# EAGLE design Sensor Short Link (EAGLE 9.6.1)
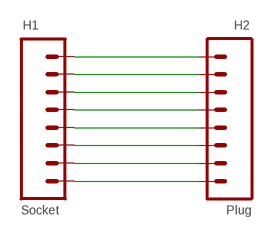
[diagram p0: schematic, sheet 1]

## Parts
H1  Socket  HEADER-1X8-GENERIC  [CONN_08-GENERIC]
H2  Plug  HEADER-1X8-GENERIC  [CONN_08-GENERIC]

## Nets
N$1: H1.8 H2.8
N$2: H1.7 H2.7
N$3: H1.6 H2.6
N$4: H1.5 H2.5
N$5: H1.4 H2.4
N$6: H1.3 H2.3
N$7: H1.2 H2.2
N$8: H1.1 H2.1

## Library data of the parts
H1 H2 = digitalconcepts:HEADER-1X8-GENERIC: Single Row 8-Pin Header

## Board
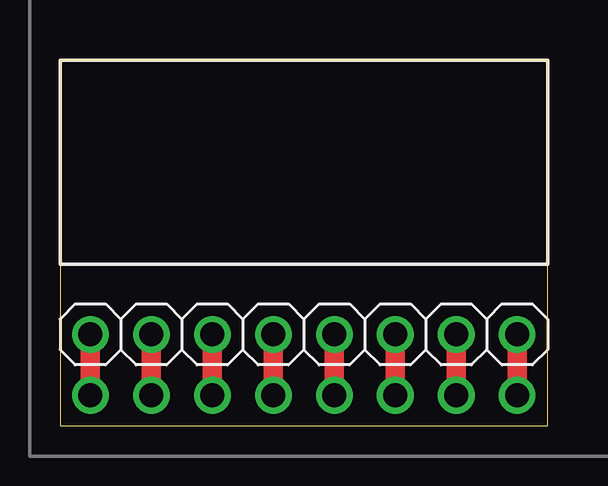
[diagram p1: board, top side]
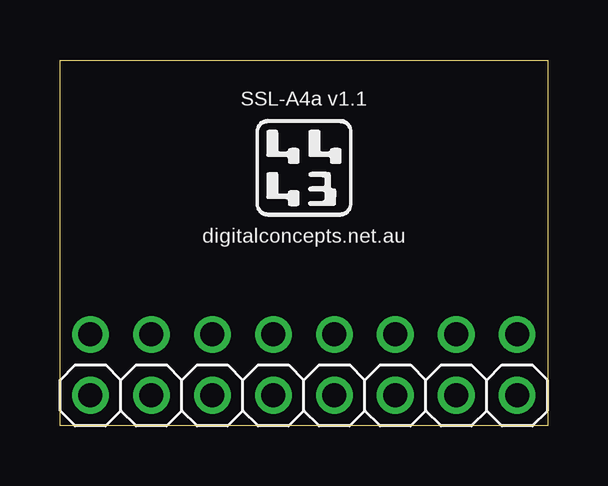
[diagram p2: board, bottom side, seen from below]

Size 20.32 x 15.24 mm. Coordinates in mm from the lower left corner, seen from the top.
Outline: 0,0 20.32,0 20.32,15.24 0,15.24 0,0
Copper layers (1*16): Top 0.035mm / dielectric 1.5mm / Bottom 0.035mm
Design rules "default *": minimum track width 6mil, minimum drill 0.35mm, track to track 6mil, track to pad 6mil, pad to pad 6mil, via to via 6mil, smd to smd 6mil, copper to edge 15mil, drill to drill 6mil, minimum pad ring 10mil, minimum via ring 8mil, stop-mask expansion 4mil, vias tented up to drill 0mil, thermal gap 10mil

### Footprints (pad centres in the part's own frame; a part is rotated, then mirrored left to right if it is on the bottom)
CONN_08-GENERIC = drill 1 pad 1.524: 1 0,0; 2 2.54,0; 3 5.08,0; 4 7.62,0; 5 10.16,0; 6 12.7,0; 7 15.24,0; 8 17.78,0

### Placement (x,y rotation side)
H1  1.27,3.81 0 top
H2  1.27,1.27 180 bottom

### Tracks (layer width: path | path; a pad name or v marks a point on that pad's centre or on a via)
N$1
  Top 0.813: H1.8 H2.8
N$2
  Top 0.813: H1.7 H2.7
N$3
  Top 0.813: H1.6 H2.6
N$4
  Top 0.813: H1.5 H2.5
N$5
  Top 0.813: H1.4 H2.4
N$6
  Top 0.813: H1.3 H2.3
N$7
  Top 0.813: H1.2 H2.2
N$8
  Top 0.813: H1.1 H2.1

### Text on the board
bPlace: SSL-A4a v1.1 | digitalconcepts.net.au